# EAGLE design MSP430G2553IN28_Test1 (EAGLE 6.5.0)
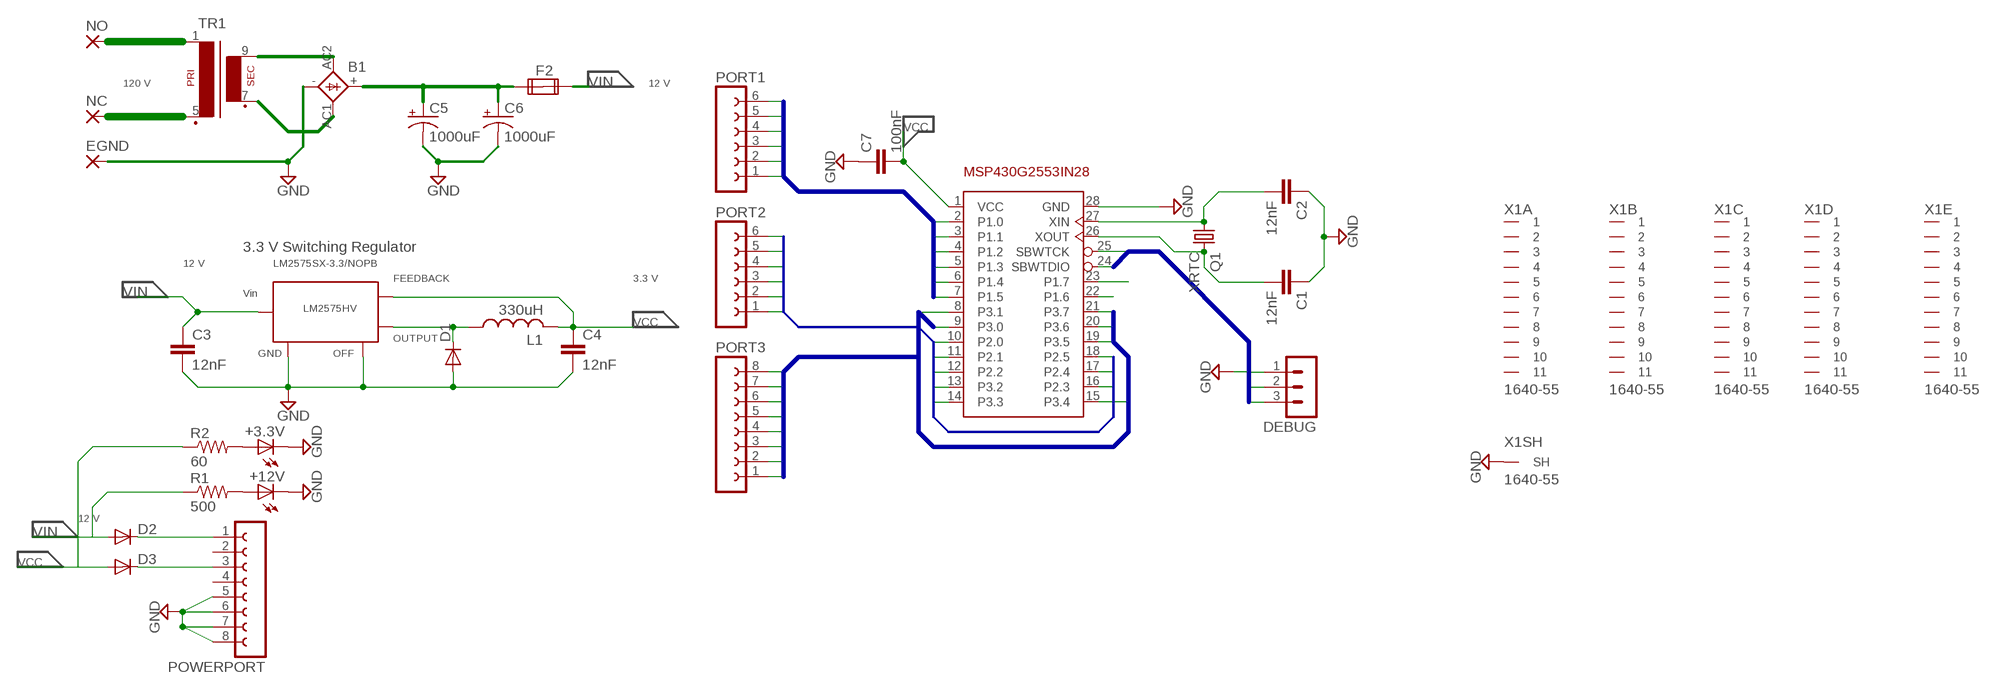
[diagram p0: schematic, sheet 1]

## Parts
+3.3V  LEDSML0603  [SML0603]
+12V  LEDSML0603  [SML0603]
B1  GBU4  [GBU4S]
C1  12nF  C-EUC0402  [C0402]
C2  12nF  C-EUC0402  [C0402]
C3  12nF  C-EUC0402  [C0402]
C4  12nF  C-EUC0402  [C0402]
C5  1000uF  CPOL-USE5-8.5  [E5-8,5]
C6  1000uF  CPOL-USE5-8.5  [E5-8,5]
C7  100nF  C-EUC0402  [C0402]
D1  DIODE-SOD106-R  [SOD106-R]
D2  DIODE-DO41-7.6  [DO41-7.6]
D3  DIODE-DO41-7.6  [DO41-7.6]
DEBUG  MA03-1  [MA03-1]
EGND  3,81/1,4  [3,81/1,4]
F2  FUSE2P  [FUSE1]
IC1  MSP430  [P-TSSOP28-1]
L1  330uH  L-USL1812  [L1812]
NC  3,81/1,4  [3,81/1,4]
NO  3,81/1,4  [3,81/1,4]
PORT1  FE06-1  [FE06]
PORT2  FE06-1  [FE06]
PORT3  FE08-1  [FE08]
POWERPORT  FE08-1  [FE08]
Q1  XRTC  CRYSTALTC26H  [TC26H]
R1  500  R-US_R0402  [R0402]
R2  60  R-US_R0402  [R0402]
TR1  VV11  [VV11]
U$1  CUSTOM_REGULATOR  [TO263-5]
X1  1640-55  [1640-55]

## Nets
DEBUG_P0: DEBUG.1
DEBUG_P1: DEBUG.2 IC1.25(SBWTCK)
DEBUG_P2: DEBUG.3 IC1.24(SBWTDIO)
GND: +3.3V.C +12V.C B1.- C1.1 C2.1 C3.2 C4.2 C5.- C6.- C7.1 D1.A EGND.1(P) IC1.28(GND) POWERPORT.5 POWERPORT.6 POWERPORT.7 POWERPORT.8 U$1.3 U$1.5 U$1.6 X1.F1(SH:SH)
N$1: C2.2 IC1.27(XIN) Q1.1
N$2: C1.2 IC1.26(XOUT) Q1.2
N$3: NC.1(P) TR1.5(P2)
N$4: NO.1(P) TR1.1
N$5: +12V.A R1.2
N$6: +3.3V.A R2.2
N$7: D2.C POWERPORT.1
N$8: D3.C POWERPORT.3
N$9: B1.AC2(AC1) TR1.9(S4)
N$10: B1.AC1(AC2) TR1.7(S3)
N$33: B1.+ C5.+ C6.+ F2.1A
P$2: D1.C L1.1 U$1.2
PORT1_0: IC1.2(P1.0) PORT1.1
PORT1_1: IC1.3(P1.1) PORT1.2
PORT1_2: IC1.4(P1.2) PORT1.3
PORT1_3: IC1.5(P1.3) PORT1.4
PORT1_4: IC1.6(P1.4) PORT1.5
PORT1_5: IC1.7(P1.5) PORT1.6
PORT1_6: IC1.22(P1.6)
PORT1_7: IC1.23(P1.7)
PORT2_0: IC1.10(P2.0) PORT2.1
PORT2_1: IC1.11(P2.1) PORT2.2
PORT2_2: IC1.12(P2.2) IC1.13(P3.2) PORT2.3
PORT2_3: IC1.14(P3.3) IC1.16(P2.3) PORT2.4
PORT2_4: IC1.17(P2.4) PORT2.5
PORT2_5: IC1.18(P2.5) PORT2.6
PORT3_0: IC1.9(P3.0) PORT3.1
PORT3_1: IC1.8(P3.1) PORT3.2
PORT3_2: PORT3.3
PORT3_3: PORT3.4
PORT3_4: IC1.15(P3.4) PORT3.5
PORT3_5: IC1.19(P3.5) PORT3.6
PORT3_6: IC1.20(P3.6) PORT3.7
PORT3_7: IC1.21(P3.7) PORT3.8
VCC: C4.1 C7.2 D3.A IC1.1(VCC) L1.2 R2.1 U$1.4
VIN: C3.1 D2.A F2.2A R1.1 U$1.1
Unconnected: F2.1B F2.2B POWERPORT.2 POWERPORT.4 X1.A1 X1.A2 X1.A3 X1.A4 X1.A5 X1.A6 X1.A7 X1.A8 X1.A9 X1.A10 X1.A11 X1.B1 X1.B2 X1.B3 X1.B4 X1.B5 X1.B6 X1.B7 X1.B8 X1.B9 X1.B10 X1.B11 X1.C1 X1.C2 X1.C3 X1.C4 X1.C5 X1.C6 X1.C7 X1.C8 X1.C9 X1.C10 X1.C11 X1.D1 X1.D2 X1.D3 X1.D4 X1.D5 X1.D6 X1.D7 X1.D8 X1.D9 X1.D10 X1.D11 X1.E1 X1.E2 X1.E3 X1.E4 X1.E5 X1.E6 X1.E7 X1.E8 X1.E9 X1.E10 X1.E11

## Buses
PORT1_[0..7]
PORT2_[0..5]
PORT3_[0..7]
DEBUG_P[0..2]

## Notes on the sheet
- 120 V | 12 V
- 3.3 V Switching Regulator
- 12 V | LM2575SX-3.3/NOPB
- 3.3 V
- 12 V

## Library data of the parts
+3.3V +12V = led:LED: LED OSRAM: - CHIPLED LG R971, LG N971, LY N971, LG Q971, LY Q971, LO R971, LY R971 LH N974, LH R974 LS Q976, LO Q976, LY Q976 LO Q996 - Hyper CHIPLED LW Q18S LB Q993, LB Q99A, LB R99A - SideLED LS A670, LO A670, LY A670, LG A670, LP A670 LB A673, LV A673, LT A673, LW A673 LH A674 LY A675 LS A676, LA A676, LO A676, LY A676, LW A676 LS A679, LY A679, LG A679 - Hyper Micro SIDELED® LS Y876, LA Y876, LO Y876, LY Y876 LT Y87S - SmartLED LW L88C, LW L88S LB L89C, LB L89S, LG L890 LS L89K, LO L89K, LY L89K LS L896, LA L896, LO L896, LY L896 - TOPLED LS T670, LO T670, LY T670, LG T670, LP T670 LSG T670, LSP T670, LSY T670, LOP T670, LYG T670 LG T671, LOG T671, LSG T671 LB T673, LV T673, LT T673, LW T673 LH T674 LS T676, LA T676, LO T676, LY T676, LB T676, LH T676, LSB T676, LW T676 LB T67C, LV T67C, LT T67C, LS T67K, LO T67K, LY T67K, LW E67C LS E67B, LA E67B, LO E67B, LY E67B, LB E67C, LV E67C, LT E67C LW T67C LS T679, LY T679, LG T679 LS T770, LO T770, LY T770, LG T770, LP T770 LB T773, LV T773, LT T773, LW T773 LH T774 LS E675, LA E675, LY E675, LS T675 LS T776, LA T776, LO T776, LY T776, LB T776 LHGB T686 LT T68C, LB T68C - Hyper Mini TOPLED® LB M676 - Mini TOPLED Santana® LG M470 LS M47K, LO M47K, LY M47K Source: http://www.osram.convergy.de LUXEON: - LUMILED® LXK2-PW12-R00, LXK2-PW12-S00, LXK2-PW14-U00, LXK2-PW14-V00 LXK2-PM12-R00, LXK2-PM12-S00, LXK2-PM14-U00 LXK2-PE12-Q00, LXK2-PE12-R00, LXK2-PE12-S00, LXK2-PE14-T00, LXK2-PE14-U00 LXK2-PB12-K00, LXK2-PB12-L00, LXK2-PB12-M00, LXK2-PB14-N00, LXK2-PB14-P00, LXK2-PB14-Q00 LXK2-PR12-L00, LXK2-PR12-M00, LXK2-PR14-Q00, LXK2-PR14-R00 LXK2-PD12-Q00, LXK2-PD12-R00, LXK2-PD12-S00 LXK2-PH12-R00, LXK2-PH12-S00 LXK2-PL12-P00, LXK2-PL12-Q00, LXK2-PL12-R00 Source: www.luxeon.com KINGBRIGHT: KA-3528ASYC Source: www.kingbright.com
B1 = rectifier:GBU4: GENERAL INSTRUMENT RECTIFIER
C1-C4 C7 = rcl:C-EU: CAPACITOR, European symbol
C5 C6 = rcl:CPOL-US: POLARIZED CAPACITOR, American symbol
D1-D3 = diode:DIODE-: DIODE
DEBUG = con-lstb:MA03-1: PIN HEADER; OC_FARNELL: unknown; OC_NEWARK: unknown
EGND NC NO = wirepad:3,81/1,4: THROUGH-HOLE PAD
F2 = special:FUSE2P: FUSE 5 x 20 mm
IC1 = msp430_board:MSP430: Custom MSP430
L1 = rcl:L-US: INDUCTOR, American symbol
PORT1 PORT2 = con-lsta:FE06-1: FEMALE HEADER; OC_FARNELL: unknown; OC_NEWARK: unknown
PORT3 POWERPORT = con-lsta:FE08-1: FEMALE HEADER; OC_FARNELL: unknown; OC_NEWARK: unknown
Q1 = crystal:CRYSTAL: CRYSTAL; OC_FARNELL: unknown; OC_NEWARK: unknown
R1 R2 = rcl:R-US_: RESISTOR, American symbol
TR1 = trafo:VV11: TRANSFORMER 1 primary winding, 1 secondary winding BLOCK
U$1 = msp430_board:CUSTOM_REGULATOR: Custom LM2575
X1 = con-commcon:1640-55: COMPACT PCI TYPE C - 55 PINS 2mm HARD METRIC SOCKETS; OC_FARNELL: unknown; OC_NEWARK: unknown

## Board
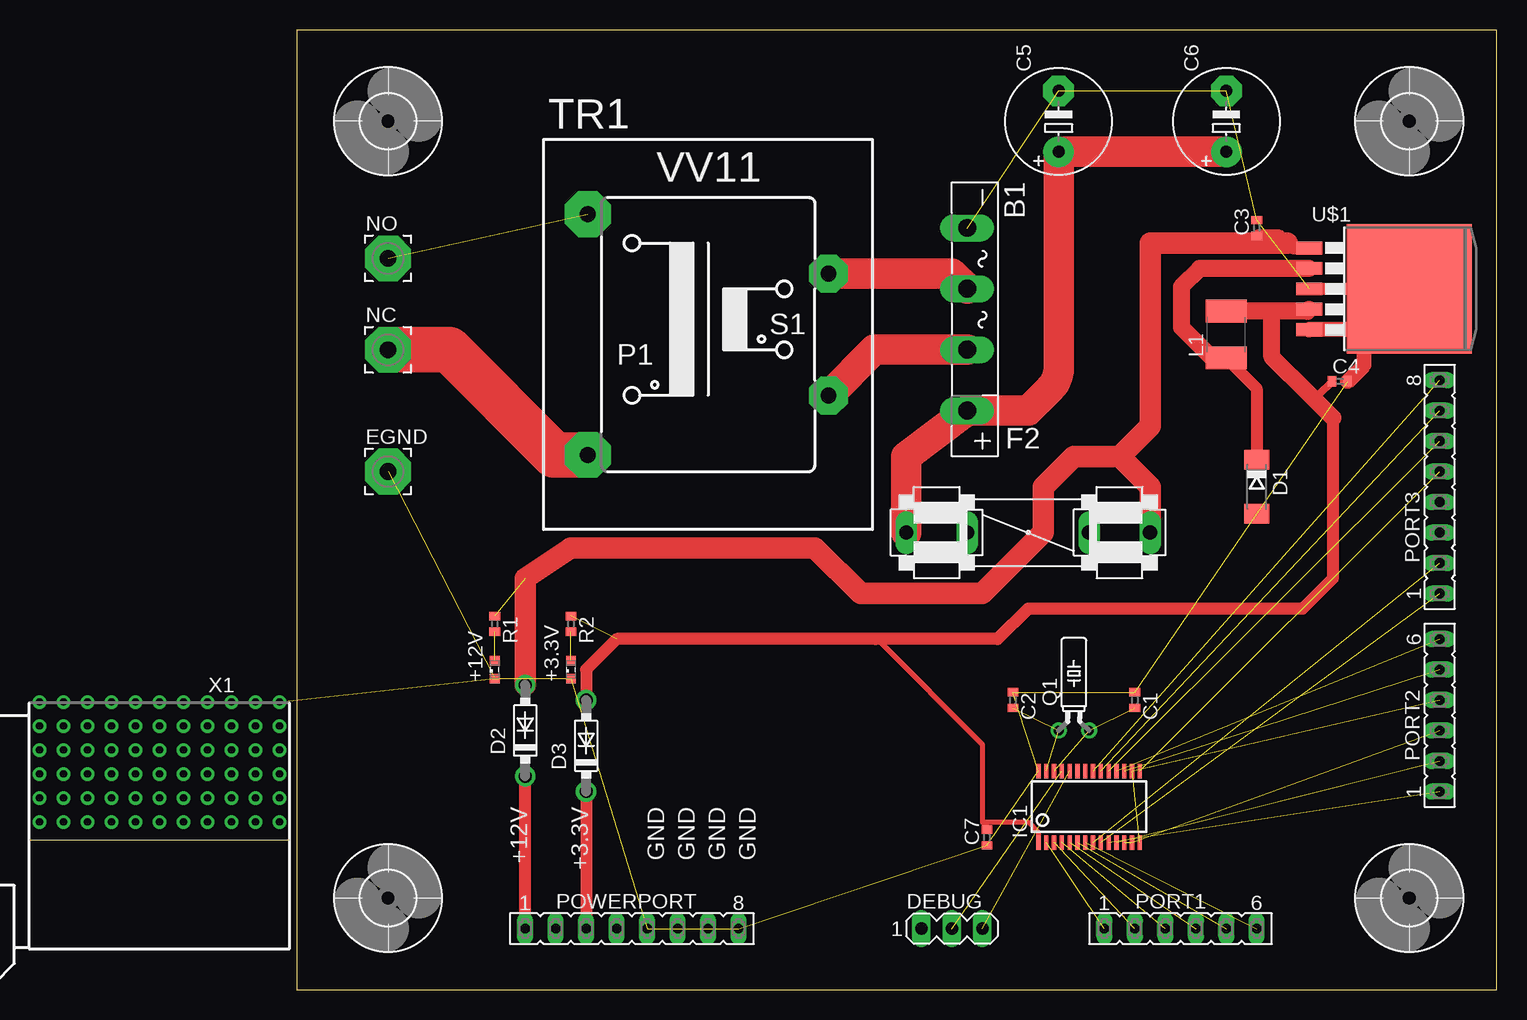
[diagram p1: board, top side]
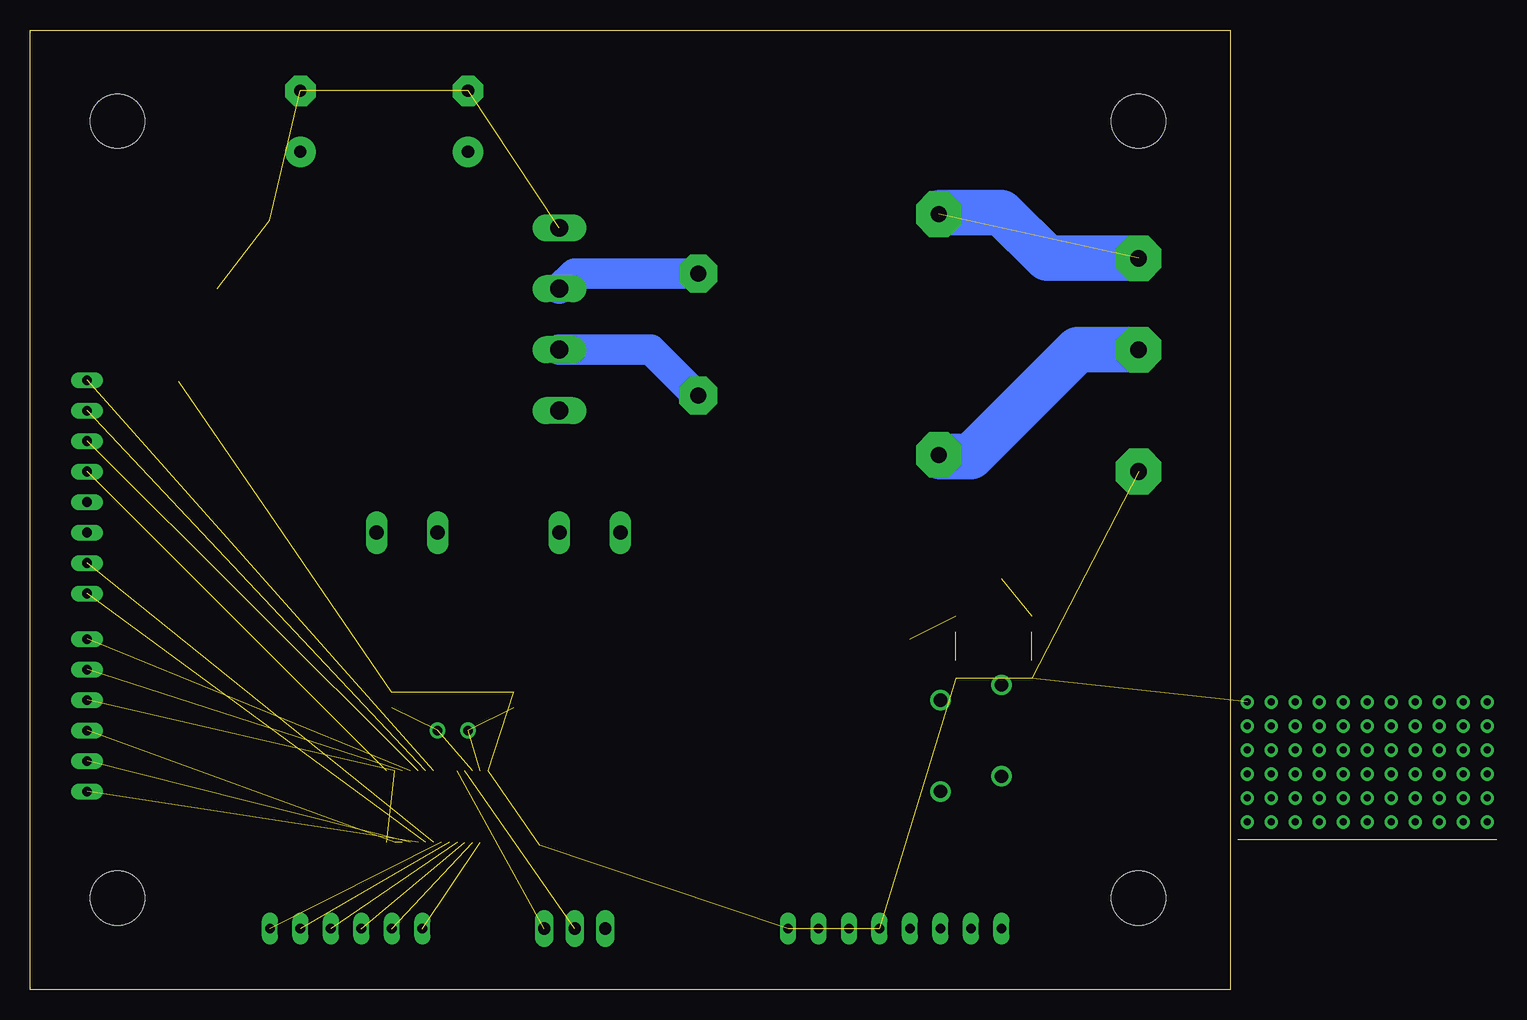
[diagram p2: board, bottom side, seen from below]

Size 100 x 80 mm. Coordinates in mm from the lower left corner, seen from the top.
Outline: 0,0 100,0 100,80 0,80 0,0
Copper layers (1*16): Top 0.035mm / dielectric 1.5mm / Bottom 0.035mm
Design rules "default *": minimum track width 0.3mm, minimum drill 24mil, track to track 0.4032mm, track to pad 0.4032mm, pad to pad 0.4032mm, via to via 0.4032mm, smd to smd 0.4032mm, copper to edge 40mil, drill to drill 0.2432mm, minimum pad ring 10mil, minimum via ring 8mil, stop-mask expansion 4mil, vias tented up to drill 0mil, thermal gap 10mil
tRestrict: area 3.8,39.4 to 29.2,68.6; area 39.4,45.7 to 59.7,62.2
bRestrict: area 3.8,39.4 to 29.2,68.6; area 39.4,45.7 to 59.7,62.2

### Footprints (pad centres in the part's own frame; a part is rotated, then mirrored left to right if it is on the bottom)
SML0603 = smd 0.8 x 0.8: A 0.75,0; C -0.75,0
GBU4S = drill 1.499 long: + 7.62,0; - -7.62,0; AC1 2.54,0; AC2 -2.54,0
C0402 = smd 0.7 x 0.9: 1 -0.65,0; 2 0.65,0
E5-8,5 = drill 1.016 pad 2.54: + -2.54,0 | drill 1.016 pad 2.54 octagon: - 2.54,0
SOD106-R = smd 1.6 x 2.1: A 2.25,0; C -2.25,0
DO41-7.6 = drill 1.1 pad 1.7: A 3.81,0; C -3.81,0
MA03-1 = drill 1.016 long: 1 -2.54,0; 2 0,0; 3 2.54,0
3,81/1,4 = drill 1.397 pad 3.81 octagon: 1 0,0
FUSE1 = drill 1.194 long: 1A -10.16,0; 1B -5.08,0; 2A 10.16,0; 2B 5.08,0
P-TSSOP28-1 = smd 0.35 x 1.2: 1 -4.225,-2.975; 2 -3.575,-2.975; 3 -2.925,-2.975; 4 -2.275,-2.975; 5 -1.625,-2.975; 6 -0.975,-2.975; 7 -0.325,-2.975; 8 0.325,-2.975; 9 0.975,-2.975; 10 1.625,-2.975; 11 2.275,-2.975; 12 2.925,-2.975; 13 3.575,-2.975; 14 4.225,-2.975; 15 4.225,2.975; 16 3.575,2.975; 17 2.925,2.975; 18 2.275,2.975; 19 1.625,2.975; 20 0.975,2.975; 21 0.325,2.975; 22 -0.325,2.975; 23 -0.975,2.975; 24 -1.625,2.975; 25 -2.275,2.975; 26 -2.925,2.975; 27 -3.575,2.975; 28 -4.225,2.975
L1812 = smd 1.9 x 3.4: 1 -1.95,0; 2 1.95,0
FE06 = drill 0.813 long: 1 -6.35,0; 2 -3.81,0; 3 -1.27,0; 4 1.27,0; 5 3.81,0; 6 6.35,0
FE08 = drill 0.813 long: 1 -8.89,0; 2 -6.35,0; 3 -3.81,0; 4 -1.27,0; 5 1.27,0; 6 3.81,0; 7 6.35,0; 8 8.89,0
TC26H = drill 0.813: 1 -1.27,0; 2 1.27,0
R0402 = smd 0.7 x 0.9: 1 -0.65,0; 2 0.65,0
VV11 = drill 1.321 pad 3.81 octagon: 1 -10.033,10.033; 5 -10.033,-10.033 | drill 1.321 pad 3.175 octagon: 7 10.033,-5.08; 9 10.033,5.08
TO263-5 = smd 1.067 x 2.159: 1 -3.404,-5.791; 2 -1.702,-5.791; 3 0,-5.791; 4 1.702,-5.791; 5 3.404,-5.791 | smd 10.8 x 10.41: 6 0,2.54
4,5 = hole 4.5: 0,0
1640-55 = drill 0.6: A1 10,1.27; A2 8,1.27; A3 6,1.27; A4 4,1.27; A5 2,1.27; A6 0,1.27; A7 -2,1.27; A8 -4,1.27; A9 -6,1.27; A10 -8,1.27; A11 -10,1.27; B1 10,3.27; B2 8,3.27; B3 6,3.27; B4 4,3.27; B5 2,3.27; B6 0,3.27; B7 -2,3.27; B8 -4,3.27; B9 -6,3.27; B10 -8,3.27; B11 -10,3.27; C1 10,5.27; C2 8,5.27; C3 6,5.27; C4 4,5.27; C5 2,5.27; C6 0,5.27; C7 -2,5.27; C8 -4,5.27; C9 -6,5.27; C10 -8,5.27; C11 -10,5.27; D1 10,7.27; D2 8,7.27; D3 6,7.27; D4 4,7.27; D5 2,7.27; D6 0,7.27; D7 -2,7.27; D8 -4,7.27; D9 -6,7.27; D10 -8,7.27; D11 -10,7.27; E1 10,9.27; E2 8,9.27; E3 6,9.27; E4 4,9.27; E5 2,9.27; E6 0,9.27; E7 -2,9.27; E8 -4,9.27; E9 -6,9.27; E10 -8,9.27; E11 -10,9.27; F1 10,11.27; F2 8,11.27; F3 6,11.27; F4 4,11.27; F5 2,11.27; F6 0,11.27; F7 -2,11.27; F8 -4,11.27; F9 -6,11.27; F10 -8,11.27; F11 -10,11.27

### Placement (x,y rotation side)
+3.3V  22.86,26.67 90 top
+12V  16.51,26.67 90 top
B1  55.88,55.88 270 top
C1  69.85,24.13 270 top
C2  59.69,24.13 270 top
C3  80.01,63.5 90 top
C4  86.94,50.71 0 top
C5  63.5,72.39 90 top
C6  77.47,72.39 90 top
C7  57.53,12.67 90 top
D1  80.01,41.91 270 top
D2  19.05,21.59 90 top
D3  24.13,20.32 90 top
DEBUG  54.61,5.08 0 top
EGND  7.62,43.18 0 top
F2  60.96,38.1 0 top
IC1  66.04,15.24 0 top
L1  77.47,54.61 90 top
NC  7.62,53.34 0 top
NO  7.62,60.96 0 top
PORT1  73.66,5.08 0 top
PORT2  95.25,22.86 90 top
PORT3  95.25,41.91 90 top
POWERPORT  27.94,5.08 0 top
Q1  64.77,21.59 0 top
R1  16.51,30.48 270 top
R2  22.86,30.48 270 top
TR1  34.29,54.61 0 top
U$1  90.17,58.42 270 top
U$2  [4,5]  7.62,7.62 0 top
U$3  [4,5]  7.62,72.39 0 top
U$4  [4,5]  92.71,72.39 0 top
U$5  [4,5]  92.71,7.62 0 top
X1  -11.43,12.7 0 top

### Tracks (layer width: path | path; a pad name or v marks a point on that pad's centre or on a via)
DEBUG_P1  (1 unrouted)
DEBUG_P2  (1 unrouted)
GND  (17 unrouted)
  Top 1.016: U$1.3 88.92,58.43 88.93,58.42 89.67,58.42 U$1.6
  Top 1.27: U$1.5 84.42,55.06 88.81,55.06 88.96,55.2 | 88.96,55.2 89.67,55.91 89.67,58.42 | C4.2 88.96,52.08 88.96,55.2
N$1  (2 unrouted)
N$2  (2 unrouted)
N$3
  Top 3.81: NC.1 12.7,53.34 21.46,44.58 TR1.5
  Bottom 3.81: NC.1 12.7,53.34 21.59,44.45 24.13,44.45
N$4  (1 unrouted)
  Bottom 3.81: NO.1 15.24,60.96 19.05,64.77 24.13,64.77
N$5  (1 unrouted)
N$6  (1 unrouted)
N$7
  Top 1.016: POWERPORT.1 D2.C
N$8
  Top 1.016: D3.C POWERPORT.3
N$9
  Top 2.54: TR1.9 54.61,59.69 B1.AC2
  Bottom 2.54: 44.45,59.69 54.61,59.69 B1.AC2
N$10
  Top 2.54: TR1.7 48.13,53.34 B1.AC1
  Bottom 2.54: 44.45,49.53 48.26,53.34 B1.AC1
N$33
  Top 2.54: C6.+ C5.+ 63.5,51.85 arc-45 62.76,50.06 60.96,48.26 B1.+ 50.8,44.45 F2.1A
P$2
  Top 1.016: L1.1 80.01,50.12 D1.C
  Top 1.422: U$1.2 75.25,60.11 73.73,58.59 73.73,55.22 76.29,52.66 L1.1
PORT1_0  (1 unrouted)
PORT1_1  (1 unrouted)
PORT1_2  (1 unrouted)
PORT1_3  (1 unrouted)
PORT1_4  (1 unrouted)
PORT1_5  (1 unrouted)
PORT2_0  (1 unrouted)
PORT2_1  (1 unrouted)
PORT2_2  (2 unrouted)
PORT2_3  (2 unrouted)
PORT2_4  (1 unrouted)
PORT2_5  (1 unrouted)
PORT3_0  (1 unrouted)
PORT3_1  (1 unrouted)
PORT3_4  (1 unrouted)
PORT3_5  (1 unrouted)
PORT3_6  (1 unrouted)
PORT3_7  (1 unrouted)
VCC  (1 unrouted)
  Top 0.406: 48.26,29.21 48.37,29.21 57.15,20.43 57.15,13.97 | 57.15,13.97 60.96,13.97 61.81,13.12 IC1.1 | 57.15,13.97 57.53,13.59 C7.2
  Top 0.61: C4.1 85.17,49.59 84.44,49.59
  Top 1.016: D3.A 24.13,26.67 26.67,29.21 48.26,29.21 58.42,29.21 60.96,31.75 83.82,31.75 86.36,34.29 86.36,47.67
  Top 1.422: U$1.4 84.22,56.56 81.28,56.56 | 81.28,56.56 L1.2 | 86.36,47.67 84.44,49.59 81.28,52.75 81.28,56.56
VIN  (1 unrouted)
  Top 1.016: U$1.1 82.96,61.82 82.55,62.23 81.93,62.85 C3.1
  Top 1.778: D2.A 19.05,34.29 22.86,36.83 43.18,36.83 46.99,33.02 57.15,33.02 62.23,38.1 62.23,41.91 64.77,44.45 68.58,44.45 | 68.58,44.45 71.12,41.91 F2.2A | 68.58,44.45 71.12,46.99 71.12,62.23 82.55,62.23

### Text on the board
tNames: +12V | +3.3V | GND | GND | GND | GND